# Altium project Nucleo Shield.PrjPcb
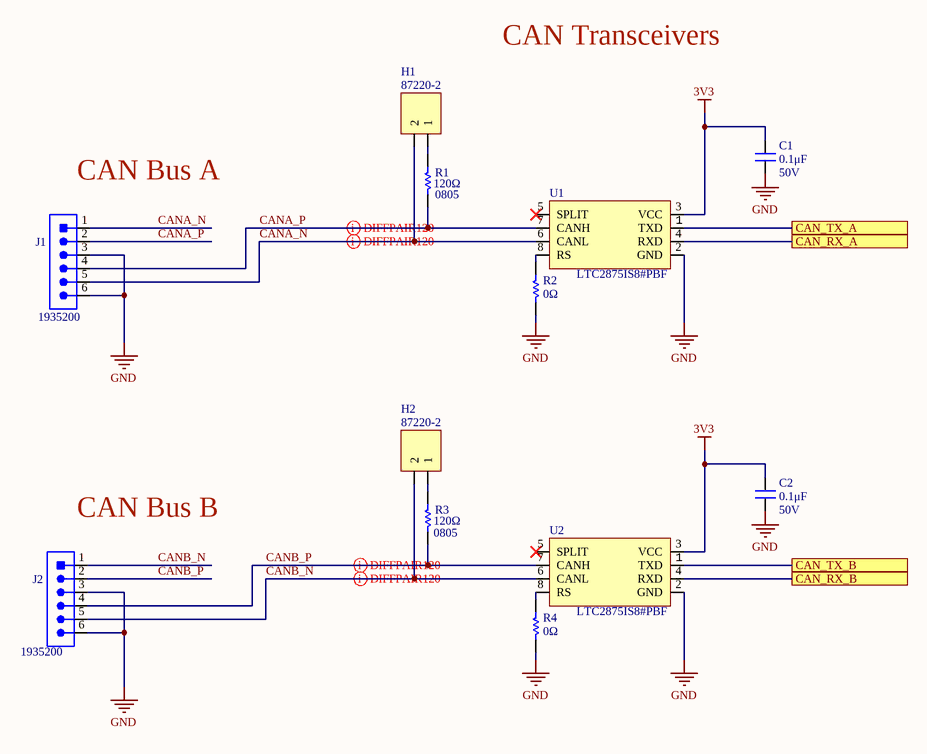
[diagram p0: SH1 - CAN.SchDoc]
3 sheets, 22 parts. Net scope: flat (ports and power ports of the same name join across sheets).
Board file: Nucleo Shield.PcbDoc
Sheets:
  SH1 - CAN.SchDoc
  SH5 - RGB LED.SchDoc
  SH7 - BROADCOM ENCODER.SchDoc

## Sheet SH1 - CAN.SchDoc: CAN Transceivers
size B; CheckedBy: Wolfgang Windholtz; Engineer: Sahil Kale; Revision: 1.0; SheetNumber: 1; SheetTotal: 7

### Parts
C1  value 0.1μF  Voltage Rating: 50V  [CAP2012]  (hidden comment: CAP_0.1uF_50V_0805)
C2  value 0.1μF  Voltage Rating: 50V  [CAP2012]  (hidden comment: CAP_0.1uF_50V_0805)
H1  Manufacturer Part Number 1: 87220-2  [HDR1X2]  (hidden comment: JUMPER)
H2  Manufacturer Part Number 1: 87220-2  [HDR1X2]  (hidden comment: JUMPER)
J1  CON_6POS_SCREW_TERM  [1935200]  (value not drawn)
J2  CON_6POS_SCREW_TERM  [1935200]  (value not drawn)
R1  value 120Ω  Package/Footprint: 0805  [RESC0805]  (hidden comment: RES_120Ω_0805_1%)
R2  value 0Ω  [RESC0805]  (hidden comment: RES_0Ω_0805)
R3  value 120Ω  Package/Footprint: 0805  [RESC0805]  (hidden comment: RES_120Ω_0805_1%)
R4  value 0Ω  [RESC0805]  (hidden comment: RES_0Ω_0805)
U1  Manufacturer Part Number 1: LTC2875IS8#PBF  [LT-S8_N]  (hidden comment: IC_CAN_TRANSCEIVER)
U2  Manufacturer Part Number 1: LTC2875IS8#PBF  [LT-S8_N]  (hidden comment: IC_CAN_TRANSCEIVER)

### Ports
CAN_RX_A, CAN_RX_B, CAN_TX_A, CAN_TX_B

### Nets
3V3: C1.1 C2.1 U1.3(VCC) U2.3(VCC)
GND: C1.2 C2.2 J1.3 J1.6 J2.3 J2.6 R2.1 R4.1 U1.2(GND) U2.2(GND)
CANA_N: H1.2 J1.1 J1.5 U1.6(CANL)
CANA_P: J1.2 J1.4 R1.1 U1.7(CANH)
CANB_N: H2.2 J2.1 J2.5 U2.6(CANL)
CANB_P: J2.2 J2.4 R3.1 U2.7(CANH)
NetH1_1: H1.1 R1.2
NetH2_1: H2.1 R3.2
NetR2_2: R2.2 U1.8(RS)
NetR4_2: R4.2 U2.8(RS)
NetU1_1: U1.1(TXD) ; port CAN_TX_A
NetU1_4: U1.4(RXD) ; port CAN_RX_A
NetU2_1: U2.1(TXD) ; port CAN_TX_B
NetU2_4: U2.4(RXD) ; port CAN_RX_B

Not connected (* = marked no-connect by the designer): U1 5(SPLIT)*; U2 5(SPLIT)*

### Layout directives
differential pair: CANA_N, CANA_P, CANB_N, CANB_P

### Notes on the sheet
- CAN Transceivers
- (near J1) CAN Bus A
- (near J2) CAN Bus B
- Title:
- Project:
- Date:
- Rev:
- Checker:
- Engineer:
- Sheet:
- of

### Library data of the parts
C1 C2 = CAP_0.1uF_50V_0805: CAP CER 0.1UF 50V X7R 0805; Manufacturer Part Number 1: GCM21BR71H104KA37K; Manufacturer 1: Murata Electronics; Package/Footprint: 0805; Supplier Part Number 1: 490-8049-1-ND; Supplier 1: Digi-Key; Dielectric: X7R; Mounting Type: SMD; LCSC Part #: C49678
H1 H2 = JUMPER: HEADER 2X1; Manufacturer 1: TE Connectivity; Package/Footprint: TH; Supplier 1: Digi-Key; Supplier Part Number 1: A26542-ND; Mounting Type: TH
J1 J2 = CON_6POS_SCREW_TERM: TERM BLK 6POS SIDE ENTRY 5MM; Manufacturer 1: Phoenix Contact; Package/Footprint: TH; Wire Gauge: 12-26AWG; Screw Thread: M2.6; Supplier 1: Digi-Key; Supplier Part Number 1: 277-1581-ND; Mounting Type: TH; Pitch: 5mm; Manufacturer Part Number 1: 1935200
R1 R3 = RES_120Ω_0805_1%: RES 120 OHM 1% 1/8W 0805; Manufacturer 1: Vishay; Manufacturer Part Number 1: CRCW0805120RFKEA; Supplier Part Number 1: 541-120CCT-ND; Supplier 1: Digi-Key; Mounting Type: SMD; LCSC Part #: C17437
R2 R4 = RES_0Ω_0805: RES 0 OHM JUMPER 1/8W 0805; Manufacturer 1: Panasonic Electronic Components; Manufacturer Part Number 1: ERJ-6GEY0R00V; Package/Footprint: 0805; Supplier Part Number 1: P0.0ACT-ND; Supplier 1: Digi-Key; Mounting Type: SMD; LCSC Part #: C17477
U1 U2 = IC_CAN_TRANSCEIVER: IC TXRX CAN 4MBPS 8SO; Manufacturer 1: Linear Technologies; Package/Footprint: 8-SOIC; Supplier Part Number 1: LTC2875IS8#PBF-ND; Supplier 1: Digi-Key; Mounting Type: SMD; LCSC Part #: C117076

## Sheet SH5 - RGB LED.SchDoc: RGB LED
size B; CheckedBy: Wolfgang Windholtz; Engineer: Sahil Kale; Revision: 1.0; SheetNumber: 5; SheetTotal: 7
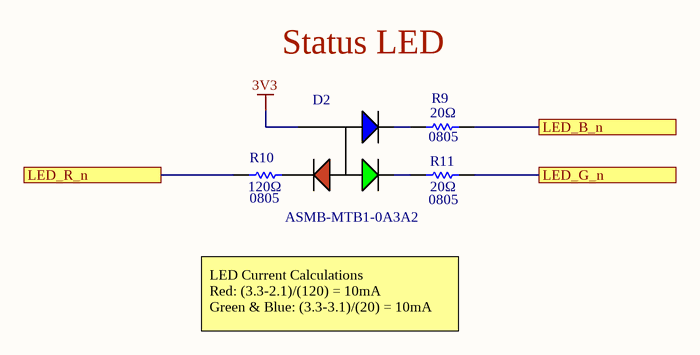
[diagram p1: SH5 - RGB LED.SchDoc]

### Parts
D2  Manufacturer Part Number 1: ASMB-MTB1-0A3A2  [LED_RGB]  (hidden comment: LED_RGB)
R9  value 20Ω  Package/Footprint: 0805  [RESC0805]  (hidden comment: RES_20Ω_0805_1%)
R10  value 120Ω  Package/Footprint: 0805  [RESC0805]  (hidden comment: RES_120Ω_0805_1%)
R11  value 20Ω  Package/Footprint: 0805  [RESC0805]  (hidden comment: RES_20Ω_0805_1%)

### Ports
LED_B_n, LED_G_n, LED_R_n

### Nets
3V3: D2.4(COMMON_ANODE)
NetD2_1: D2.1(CATHODE_(RED)) R10.2
NetD2_2: D2.2(CATHODE_(GREEN)) R11.1
NetD2_3: D2.3(CATHODE_(BLUE)) R9.1
NetR9_2: R9.2 ; port LED_B_n
NetR10_1: R10.1 ; port LED_R_n
NetR11_2: R11.2 ; port LED_G_n

### Notes on the sheet
- Status LED
- LED Current Calculations
  Red: (3.3-2.1)/(120) = 10mA
  Green & Blue: (3.3-3.1)/(20) = 10mA
- Title:
- Project:
- Date:
- Rev:
- Checker:
- Engineer:
- Sheet:
- of

### Library data of the parts
D2 = LED_RGB: LED RGB DIFFUSED 4PLCC SMD; Manufacturer 1: Broadcom; Color: Blue,Green,Red; Lens Color: White; Viewing Angle: 115°; Lens Style: Round; Luminous Intensity: 350mcd; Dominant Wavelength: 470nm; Forward Voltage: 3.1V; Test Current: 20mA; Package/Footprint: 4-PLCC; Supplier 1: Digi-Key; Number of Pins: 4; Lens Transparency: Diffused; Supplier Part Number 1: 516-3280-1-ND; Mounting Type: SMD
R9 R11 = RES_20Ω_0805_1%: RES 20 OHM 1% 1/8W 0805; Manufacturer 1: Yageo; Manufacturer Part Number 1: RC0805FR-0720RL; Supplier Part Number 1: 311-20.0CRCT-ND; Supplier 1: Digi-Key; Mounting Type: SMD; LCSC Part #: C17581
R10 = RES_120Ω_0805_1%: as R1 on sheet SH1 - CAN; Supplier Part Number 1: 541-120CCT-ND; Supplier 1: Digi-Key; Mounting Type: SMD; LCSC Part #: C17437

## Sheet SH7 - BROADCOM ENCODER.SchDoc: Broadcom Encoder
size B; CheckedBy: Wolfgang Windholtz; Engineer: Sahil Kale; Revision: 1.0; SheetNumber: 7; SheetTotal: 7
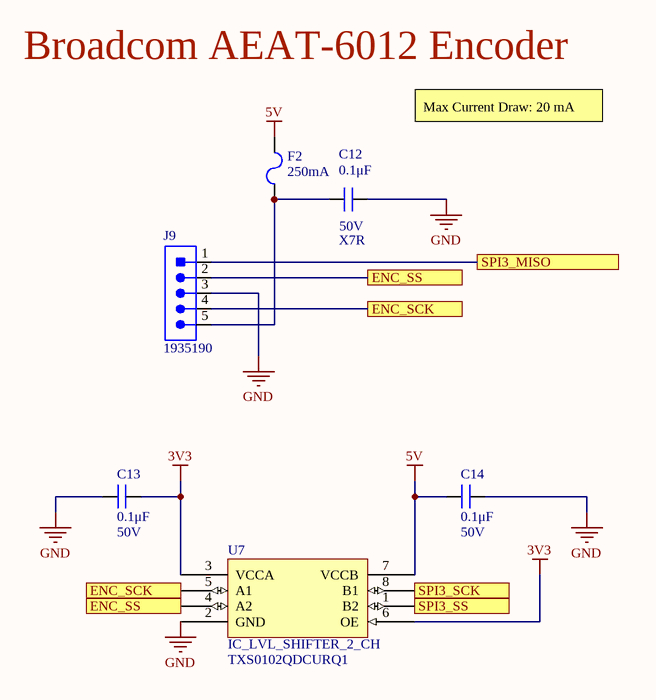
[diagram p2: SH7 - BROADCOM ENCODER.SchDoc]

### Parts
C12  value 0.1μF  Dielectric: X7R  Voltage Rating: 50V  [CAP0603]  (hidden comment: CAP_0.1uF_50V_0603)
C13  value 0.1μF  Voltage Rating: 50V  [CAP2012]  (hidden comment: CAP_0.1uF_50V_0805)
C14  value 0.1μF  Voltage Rating: 50V  [CAP2012]  (hidden comment: CAP_0.1uF_50V_0805)
F2  Current Rating: 250mA  [FUSE_0603]  (hidden comment: FUSE_250mA_0603)
J9  CON_5POS_SCREW_TERM  [1935190]  (value not drawn)
U7  IC_LVL_SHIFTER_2_CH  [TXS0102QDCURQ1]

### Ports
ENC_SCK, ENC_SS, SPI3_MISO, SPI3_SCK, SPI3_SS

### Nets
3V3: C13.2 U7.3(VCCA) U7.6(OE)
5V: C14.1 F2.2 U7.7(VCCB)
GND: C12.1 C13.1 C14.2 J9.3 U7.2(GND)
NetC12_2: C12.2 F2.1 J9.5
NetJ9_1: J9.1 ; port SPI3_MISO
NetJ9_2: J9.2 U7.4(A2) ; port ENC_SS
NetJ9_4: J9.4 U7.5(A1) ; port ENC_SCK
NetU7_1: U7.1(B2) ; port SPI3_SS
NetU7_8: U7.8(B1) ; port SPI3_SCK

### Notes on the sheet
- Broadcom AEAT-6012 Encoder
- Max Current Draw: 20 mA
- Title:
- Project:
- Date:
- Rev:
- Reviewer:
- Engineer:
- Sheet:
- of

### Library data of the parts
C12 = CAP_0.1uF_50V_0603: CAP CER 0.1UF 50V X7R 0603; Manufacturer Part Number 1: CC0603KRX7R9BB104; Manufacturer 1: Yageo; Package/Footprint: 0603; Supplier Part Number 1: 311-1344-1-ND; Supplier 1: Digi-Key; Mounting Type: SMD
C13 C14 = CAP_0.1uF_50V_0805: CAP CER 0.1UF 50V X7R 0805; Manufacturer 1: Murata Electronics; Manufacturer Part Number 1: GCM21BR71H104KA37K; Package/Footprint: 0805; Mounting Type: SMD; Supplier 1: Digi-Key; Supplier Part Number 1: 490-8049-1-ND; Dielectric: X7R; LCSC Part #: C49678
F2 = FUSE_250mA_0603: FUSE SMD 250mA 32V; Manufacturer 1: Littelfuse; Manufacturer Part Number 1: 0467.250NRHF; Package/Footprint: 0603; Voltage Rating (DC): 32V; Supplier 1: Digi-Key; Supplier Part Number 1: F6020CT-ND; Mounting Type: SMD
J9 = CON_5POS_SCREW_TERM: TERM BLK 5POS SIDE ENTRY 5MM; Manufacturer 1: Phoenix Contact; Package/Footprint: TH; Supplier 1: Digi-Key; Mounting Type: TH; Supplier Part Number 1: 277-1580-ND; Manufacturer Part Number 1: 1935190
U7 = IC_LVL_SHIFTER_2_CH: IC TRNSLTR BIDIRECTIONAL US8; Manufacturer 1: Texas Instruments; Package Body Material: Plastic; Interface IC Type: INTERFACE CIRCUIT; Number of Functions: 1; Max Supply Voltage: 4.6V; Min Supply Voltage: -0.5V; Supply Voltage-Nom: 3.3V; Supplier 1: Digi-Key; RoHS: Yes; Category: Interface ICs; Stock 1: 25079; Pricing 1: 1=0.82000, 10=0.71900, 25=0.67600, 100=0.55150, 250=0.51232, 500=0.43600, 1000=0.34880 (USD); Package Code: VSSOP; Number of Pins: 8; Package Shape: Rectangular; Terminal Finish: Nickel; Min Operating Temperature: -40°C; Max Operating Temperature: 125°C; JESD-609 Code: e4; JESD-30 Code: R-PDSO-G8; Moisture Sensitivity Level: 2; Package Style: SMALL OUTLINE, VERY THIN PROFILE, SHRINK PITCHMeter; Peak Reflow Temperature (Cel): 260°C; Surface Mount: Yes; Terminal Form: Gull Wing; Terminal Position: DUAL; Length: 2.3mm; Width: 2mm; Height - Seated (Max): 0.9mm; Terminal Pitch: 0.5mm; Temperature Grade: AUTOMOTIVE; ComponentLink1URL: https://www.ti.com:443/lit/ds/symlink/txs0102-q1.pdf?src-supplier=IHS+Markit; ComponentLink1Description: https://www.ti.com:443/lit/ds/symlink/txs0102-q1.pdf?src-supplier=IHS+Markit; ComponentLink2URL: https://datasheet.ciiva.com/48438/txs0102-q1-48438266.pdf?src-supplier=Avnet; ComponentLink2Description: https://datasheet.ciiva.com/48438/txs0102-q1-48438266.pdf?src-supplier=Avnet; Supplier Part Number 1: 296-37938-1-ND; Manufacturer Part Number 1: TXS0102QDCURQ1

## Nets that join several sheets
3V3: SH1 - CAN (C1.1 C2.1 U1.3 U2.3), SH5 - RGB LED (D2.4), SH7 - BROADCOM ENCODER (C13.2 U7.3 U7.6)
GND: SH1 - CAN (10 pins), SH7 - BROADCOM ENCODER (5 pins)